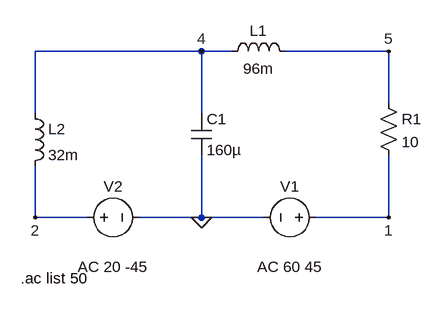
[diagram p0: schematic ex1.asc]
ex1.asc, the LTspice schematic file:
Version 4
SHEET 1 880 680
WIRE 0 16 -256 16
WIRE 48 16 0 16
WIRE 288 16 128 16
WIRE 288 96 288 16
WIRE -256 112 -256 16
WIRE 0 112 0 16
WIRE -256 272 -256 192
WIRE -176 272 -256 272
WIRE 0 272 0 176
WIRE 0 272 -96 272
WIRE 96 272 0 272
WIRE 288 272 288 176
WIRE 288 272 176 272
FLAG 0 272 0
FLAG 288 272 1
FLAG -256 272 2
FLAG 0 16 4
FLAG 288 16 5
SYMBOL res 272 80 R0
SYMATTR InstName R1
SYMATTR Value 10
SYMBOL ind 32 32 R270
WINDOW 0 32 56 VTop 2
WINDOW 3 5 56 VBottom 2
SYMATTR InstName L1
SYMATTR Value 96m
SYMBOL ind -272 96 R0
SYMATTR InstName L2
SYMATTR Value 32m
SYMBOL cap -16 112 R0
SYMATTR InstName C1
SYMATTR Value 160µ
SYMBOL voltage 192 272 R90
WINDOW 0 -32 56 VBottom 2
WINDOW 3 32 56 VTop 2
WINDOW 123 60 56 VTop 2
WINDOW 39 0 0 Left 0
SYMATTR InstName V1
SYMATTR Value ""
SYMATTR Value2 AC 60 45
SYMBOL voltage -192 272 R270
WINDOW 0 32 56 VTop 2
WINDOW 3 -32 56 VBottom 2
WINDOW 123 -60 56 VBottom 2
WINDOW 39 0 0 Left 0
SYMATTR InstName V2
SYMATTR Value ""
SYMATTR Value2 AC 20 -45
TEXT -278 366 Left 2 !.ac list 50

The netlist it stands for:
* ex1.asc
R1 5 1 10
L1 4 5 96m
L2 4 2 32m
C1 4 0 160µ
V1 1 0 AC 60 45
V2 2 0 AC 20 -45
.ac list 50
.backanno
.end

* Results of the author's LTspice run, read from the files saved beside the schematic
* AC Analysis:
*   frequency = 50 
*   V(5) = 28.37 V
*   V(1) = 42.43 V
*   V(4) = 28.5 V
*   V(2) = 14.14 V
*   I(C1) = 991.4 µA
*   I(L2) = 1.405 A
*   I(L1) = -1.406 A
*   I(R1) = -1.406 A
*   I(V2) = 1.405 A
*   I(V1) = -1.406 A